# EAGLE design SCFschem (EAGLE 8.3.1)
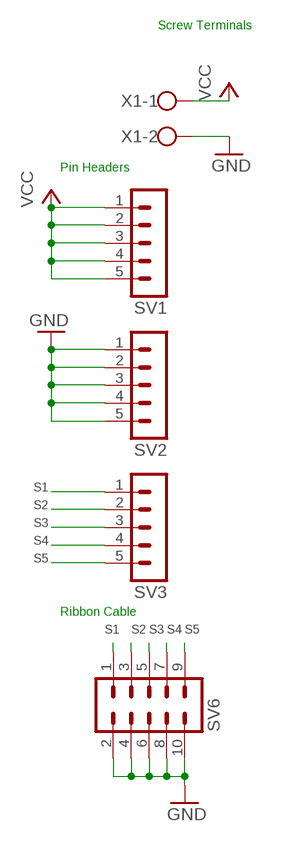
[diagram p0: schematic, sheet 1]

## Parts
SV1  MA05-1  [MA05-1]
SV2  MA05-1  [MA05-1]
SV3  MA05-1  [MA05-1]
SV6  MA05-2  [MA05-2]
X1  1X02_5MM_SCREW  [W237-102]

## Nets
GND: SV2.1 SV2.2 SV2.3 SV2.4 SV2.5 SV6.2 SV6.4 SV6.6 SV6.8 SV6.10 X1.2
S1: SV3.1 SV6.1
S2: SV3.2 SV6.3
S3: SV3.3 SV6.5
S4: SV3.4 SV6.7
S5: SV3.5 SV6.9
VCC: SV1.1 SV1.2 SV1.3 SV1.4 SV1.5 X1.1

## Notes on the sheet
- Screw Terminals
- Pin Headers
- Ribbon Cable

## Library data of the parts
SV1-SV3 = con-lstb:MA05-1: PIN HEADER; OC_FARNELL: unknown; OC_NEWARK: unknown
SV6 = con-lstb:MA05-2: PIN HEADER; OC_FARNELL: unknown; OC_NEWARK: unknown
X1 = ECE388:1X02_5MM_SCREW: WAGO SCREW CLAMP; MPN: 237-102; OC_FARNELL: unknown; OC_NEWARK: 70K9898

## Board
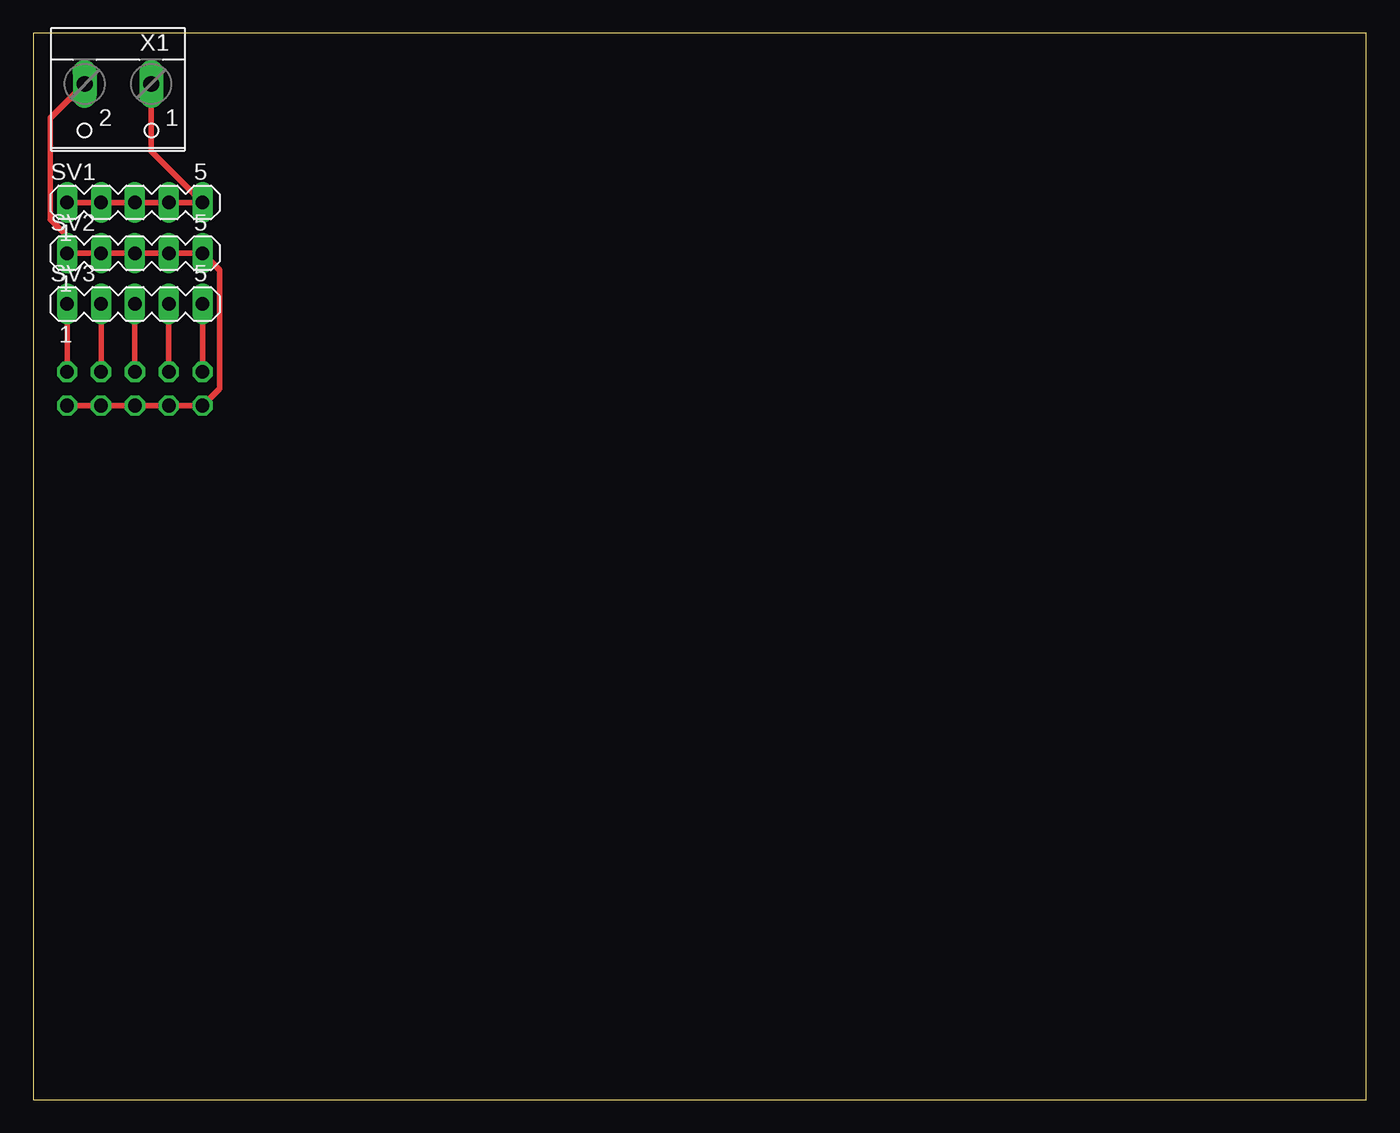
[diagram p1: board, top side]
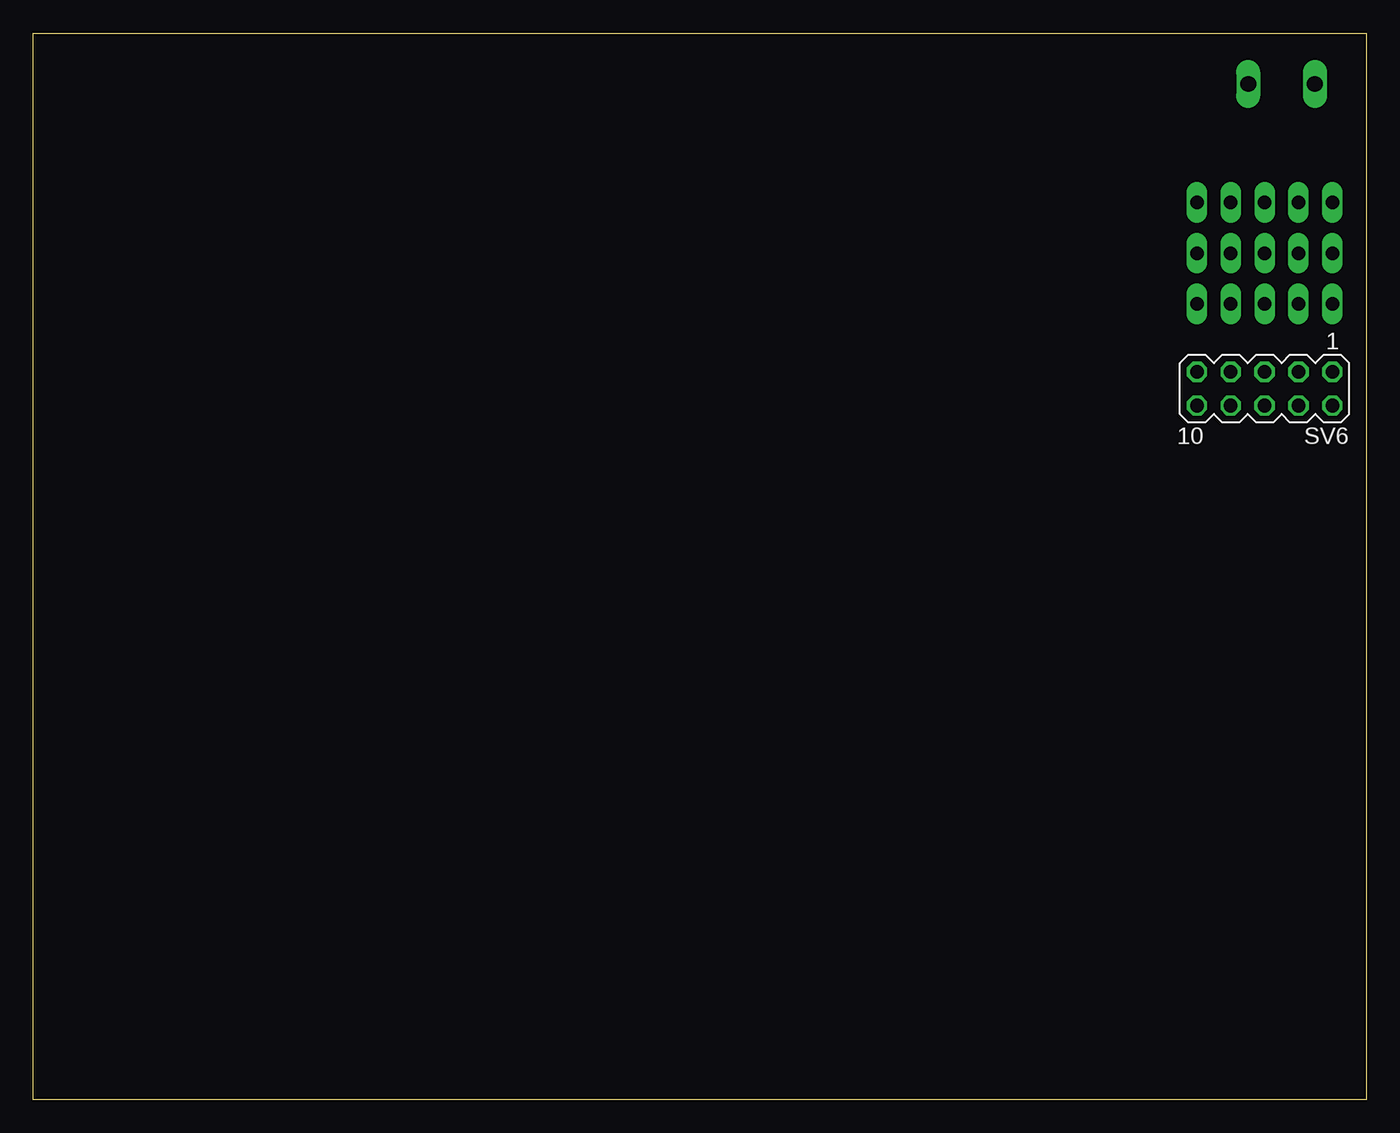
[diagram p2: board, bottom side, seen from below]

Size 100 x 80 mm. Coordinates in mm from the lower left corner, seen from the top.
Outline: 0,0 100,0 100,80 0,80 0,0
Copper layers (1*16): Top 0.035mm / dielectric 1.5mm / Bottom 0.035mm
Design rules "Dirty8TS": minimum track width 8mil, minimum drill 15mil, track to track 8mil, track to pad 8mil, pad to pad 8mil, via to via 8mil, smd to smd 0mil, copper to edge 10mil, drill to drill 10mil, minimum pad ring 10mil, minimum via ring 6mil, stop-mask expansion 2mil, vias tented up to drill 25mil, thermal gap 10mil

### Footprints (pad centres in the part's own frame; a part is rotated, then mirrored left to right if it is on the bottom)
MA05-1 = drill 1.016 long: 1 -5.08,0; 2 -2.54,0; 3 0,0; 4 2.54,0; 5 5.08,0
MA05-2 = drill 1.016 octagon: 1 -5.08,-1.27; 2 -5.08,1.27; 3 -2.54,-1.27; 4 -2.54,1.27; 5 0,-1.27; 6 0,1.27; 7 2.54,-1.27; 8 2.54,1.27; 9 5.08,-1.27; 10 5.08,1.27
W237-102 = drill 1.194 long: 1 -2.5,-1.27; 2 2.5,-1.27

### Placement (x,y rotation side)
SV1  7.62,67.31 0 top
SV2  7.62,63.5 0 top
SV3  7.62,59.69 0 top
SV6  7.62,53.34 180 bottom
X1  6.35,74.93 180 top

### Tracks (layer width: path | path; a pad name or v marks a point on that pad's centre or on a via)
GND
  Top 0.406: SV6.2 SV6.4 SV6.6 SV6.8 SV6.10 13.97,53.34 13.97,62.23 SV2.5 SV2.4 SV2.3 SV2.2 SV2.1 2.54,64.77 1.27,66.04 1.27,73.62 X1.2
S1
  Top 0.406: SV3.1 SV6.1
S2
  Top 0.406: SV3.2 SV6.3
S3
  Top 0.406: SV3.3 SV6.5
S4
  Top 0.406: SV3.4 SV6.7
S5
  Top 0.406: SV3.5 SV6.9
VCC
  Top 0.406: SV1.1 SV1.2 SV1.3 SV1.4 SV1.5 8.85,71.16 X1.1